# EAGLE design PinExpander (EAGLE 5.10)
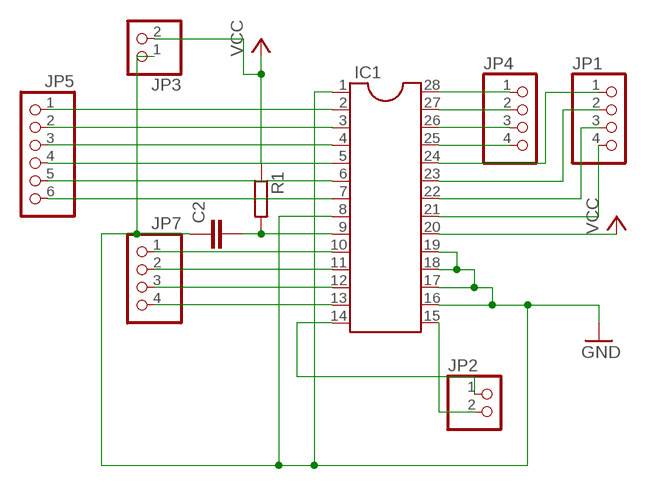
[diagram p0: schematic, sheet 1]

## Parts
C2  C-EU050-025X075  [C050-025X075]
IC1  DIL28-3  [DIL28-3]
JP1  PINHD-1X4  [1X04]
JP2  PINHD-1X2  [1X02]
JP3  PINHD-1X2  [1X02]
JP4  PINHD-1X4  [1X04]
JP5  PINHD-1X6  [1X06]
JP7  PINHD-1X4  [1X04]
R1  R-EU_0207/10  [0207/10]

## Nets
GND: C2.1 IC1.1 IC1.8 IC1.16 IC1.17 IC1.18 IC1.19 JP3.1
N$1: IC1.25 JP4.4
N$2: IC1.26 JP4.3
N$3: C2.2 IC1.9 R1.2
N$4: IC1.14 JP2.1
N$5: IC1.21 JP1.4
N$6: IC1.22 JP1.3
N$7: IC1.23 JP1.2
N$8: IC1.24 JP1.1
N$9: IC1.15 JP2.2
N$11: IC1.27 JP4.2
N$12: IC1.28 JP4.1
N$13: IC1.2 JP5.1
N$14: IC1.3 JP5.2
N$15: IC1.4 JP5.3
N$16: IC1.5 JP5.4
N$17: IC1.6 JP5.5
N$18: IC1.7 JP5.6
N$21: IC1.13 JP7.4
N$22: IC1.12 JP7.3
N$23: IC1.11 JP7.2
N$24: IC1.10 JP7.1
VCC: IC1.20 JP3.2 R1.1

## Library data of the parts
C2 = rcl:C-EU: CAPACITOR, European symbol
IC1 = ic-package:DIL28: Dual In Line
JP1 JP4 JP7 = pinhead:PINHD-1X4: PIN HEADER
JP2 JP3 = pinhead:PINHD-1X2: PIN HEADER
JP5 = pinhead:PINHD-1X6: PIN HEADER
R1 = rcl:R-EU_: RESISTOR, European symbol

## Board
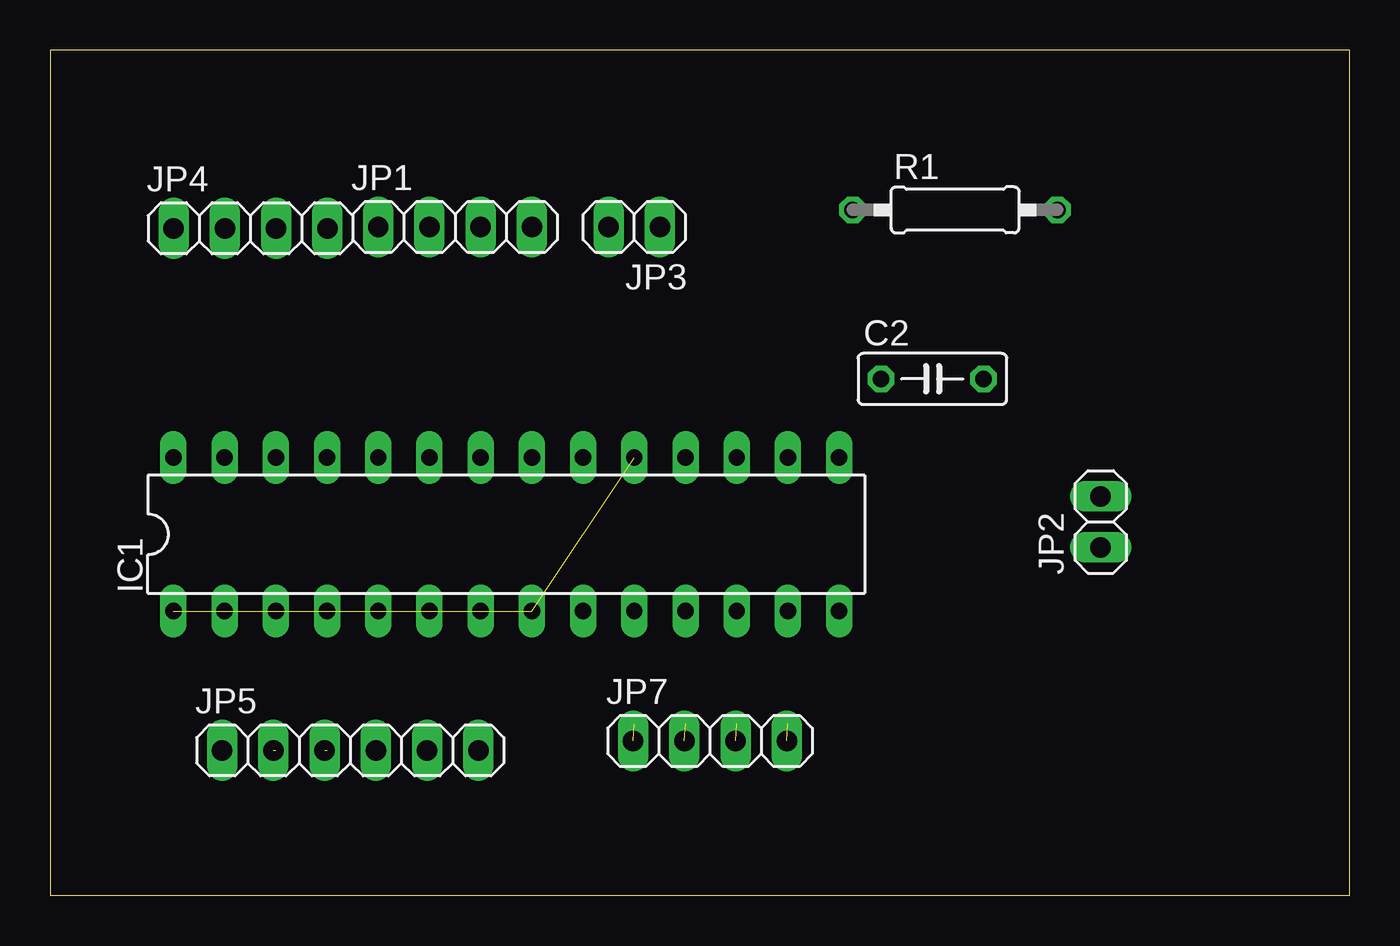
[diagram p1: board, top side]
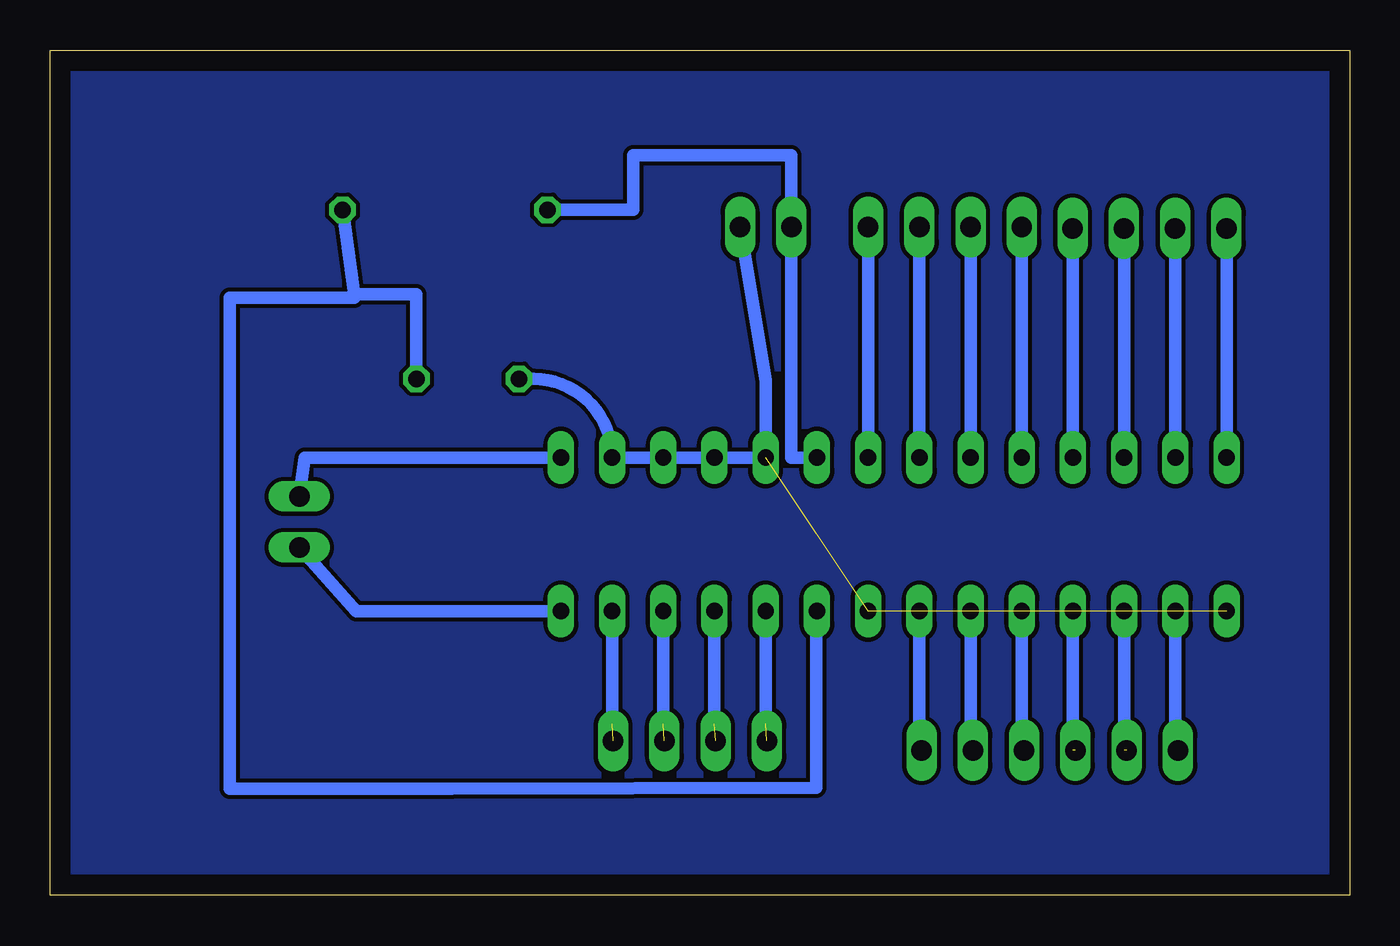
[diagram p2: board, bottom side, seen from below]

Size 64.44 x 41.9 mm. Coordinates in mm from the lower left corner, seen from the top.
Outline: 0,0 64.44,0 64.44,41.9 0,41.9 0,0
Copper layers (1*16): Top 0.035mm / dielectric 1.5mm / Bottom 0.035mm
Design rules "default": minimum track width 10mil, minimum drill 24mil, track to track 8mil, track to pad 8mil, pad to pad 8mil, via to via 8mil, smd to smd 8mil, copper to edge 40mil, drill to drill 8mil, minimum pad ring 10mil, minimum via ring 8mil, stop-mask expansion 4mil, vias tented up to drill 0mil, thermal gap 10mil

### Footprints (pad centres in the part's own frame; a part is rotated, then mirrored left to right if it is on the bottom)
C050-025X075 = drill 0.813 octagon: 1 -2.54,0; 2 2.54,0
DIL28-3 = drill 0.813 long: 1 -16.51,-3.81; 2 -13.97,-3.81; 3 -11.43,-3.81; 4 -8.89,-3.81; 5 -6.35,-3.81; 6 -3.81,-3.81; 7 -1.27,-3.81; 8 1.27,-3.81; 9 3.81,-3.81; 10 6.35,-3.81; 11 8.89,-3.81; 12 11.43,-3.81; 13 13.97,-3.81; 14 16.51,-3.81; 15 16.51,3.81; 16 13.97,3.81; 17 11.43,3.81; 18 8.89,3.81; 19 6.35,3.81; 20 3.81,3.81; 21 1.27,3.81; 22 -1.27,3.81; 23 -3.81,3.81; 24 -6.35,3.81; 25 -8.89,3.81; 26 -11.43,3.81; 27 -13.97,3.81; 28 -16.51,3.81
1X04 = drill 1.016 long: 1 -3.81,0; 2 -1.27,0; 3 1.27,0; 4 3.81,0
1X02 = drill 1.016 long: 1 -1.27,0; 2 1.27,0
1X06 = drill 1.016 long: 1 -6.35,0; 2 -3.81,0; 3 -1.27,0; 4 1.27,0; 5 3.81,0; 6 6.35,0
0207/10 = drill 0.813 octagon: 1 -5.08,0; 2 5.08,0

### Placement (x,y rotation side)
C2  43.74,25.61 0 top
IC1  22.61,17.9 0 top
JP1  20.07,33.14 0 top
JP2  52.09,18.51 90 top
JP3  28.96,33.14 180 top
JP4  9.92,33.07 0 top
JP5  14.87,7.18 0 top
JP7  32.71,7.65 0 top
R1  44.87,33.99 0 top

### Tracks (layer width: path | path; a pad name or v marks a point on that pad's centre or on a via)
GND  (2 unrouted)
  Bottom 0.61: JP3.1 28.96,25.52 IC1.19 IC1.18 IC1.17 IC1.16 arc-90 40.48,25.61 C2.1
N$1
  Bottom 0.61: IC1.25 13.73,25.38 JP4.4
N$2
  Bottom 0.61: JP4.3 11.18,30.58 IC1.26
N$3
  Bottom 0.61: IC1.9 26.46,14.09 26.46,5.33 44.52,5.28 55.55,5.28 55.55,29.64 49.38,29.64 49.38,29.8 | 49.38,29.8 46.28,29.8 C2.2 | 49.38,29.8 R1.2
N$4
  Bottom 0.61: IC1.14 49.28,14.09 JP2.1
N$5
  Bottom 0.61: IC1.21 JP1.4
N$6
  Bottom 0.61: IC1.22 JP1.3
N$7
  Bottom 0.61: IC1.23 JP1.2
N$8
  Bottom 0.61: IC1.24 JP1.1
N$9
  Bottom 0.61: IC1.15 51.82,21.71 JP2.2
N$10
  pour Bottom: 0.08,41.8 64.25,41.8 64.25,0.08 0.08,0.08 0.08,41.72 0.16,41.72
N$11
  Bottom 0.61: JP4.2 8.64,32.83 IC1.27
N$12
  Bottom 0.61: JP4.1 6.1,31.7 IC1.28
N$13
  Bottom 0.61: JP5.1 8.64,7.18 IC1.2
N$14  (1 unrouted)
  Bottom 0.61: 11.18,7.18 IC1.3
N$15  (1 unrouted)
  Bottom 0.61: 13.72,7.18 IC1.4
N$16
  Bottom 0.61: JP5.4 16.26,7.18 IC1.5
N$17
  Bottom 0.61: JP5.5 18.8,7.18 IC1.6
N$18
  Bottom 0.61: JP5.6 21.34,7.18 IC1.7
N$21  (1 unrouted)
  Bottom 0.61: 36.58,8.51 IC1.13
N$22  (1 unrouted)
  Bottom 0.61: 34.04,8.51 IC1.12
N$23  (1 unrouted)
  Bottom 0.61: 31.5,8.51 IC1.11
N$24  (1 unrouted)
  Bottom 0.61: 28.96,8.51 IC1.10
VCC
  Bottom 0.61: R1.1 35.53,33.99 35.53,36.71 27.69,36.71 JP3.2 27.69,21.71 IC1.20